# Altium schematic sheet 05_Pressure_and_LoadCell.SchDoc
size A4; DocumentNumber: 5; SheetNumber: 5; SheetTotal: 7
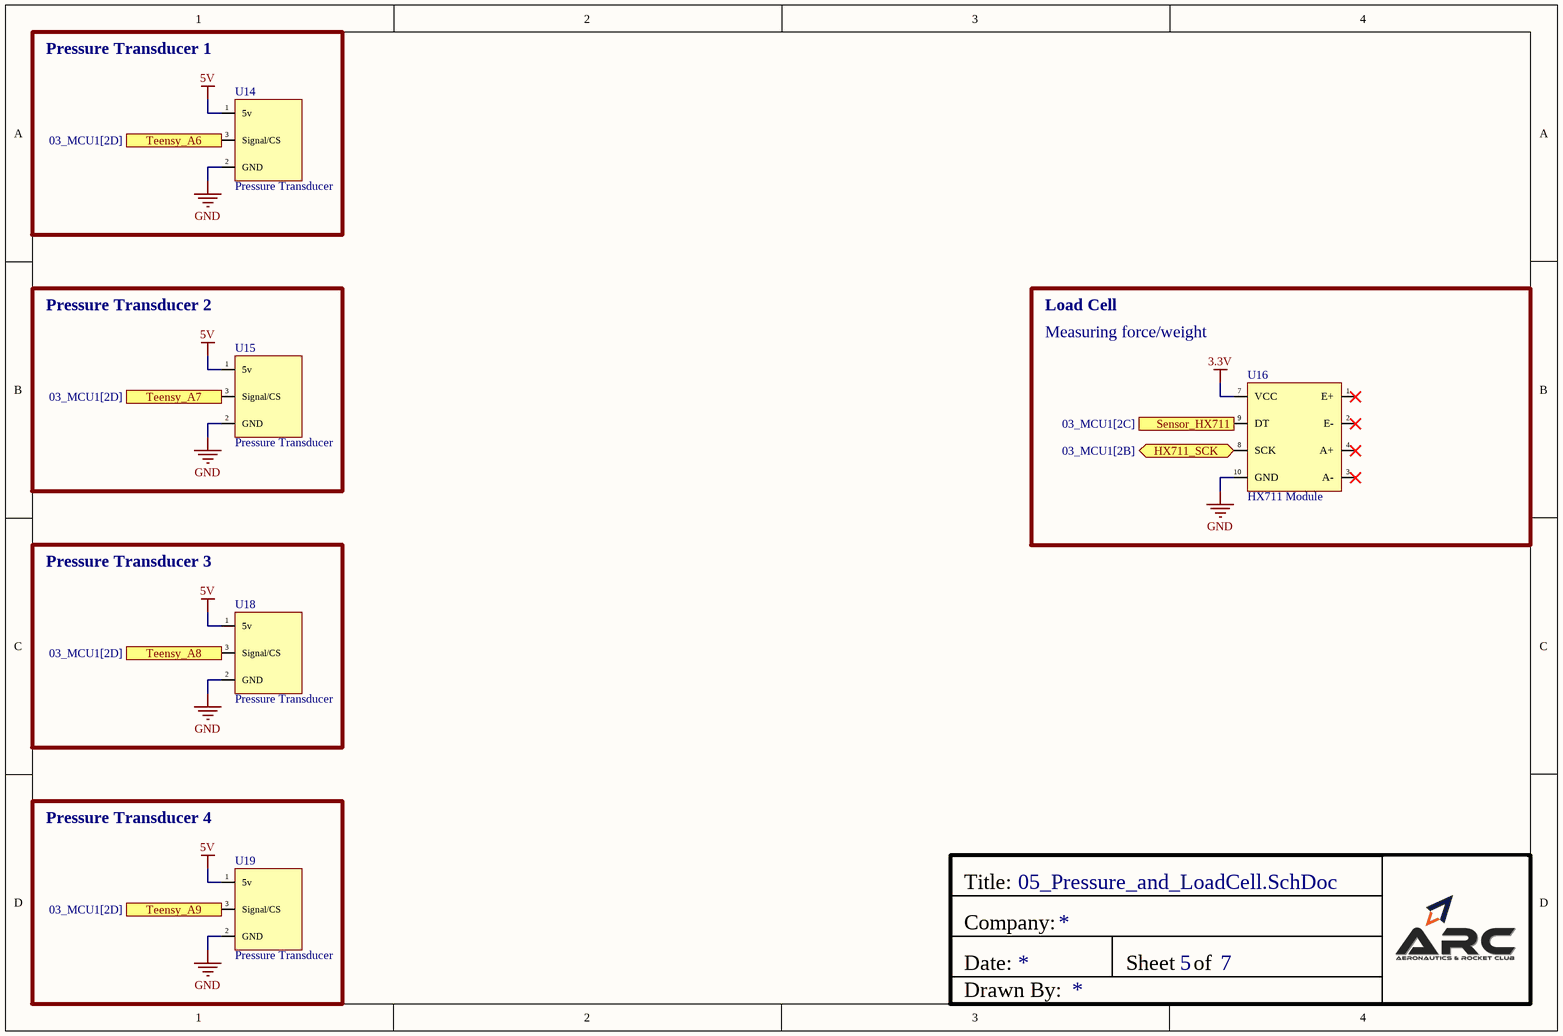
[diagram p0: 05_Pressure_and_LoadCell.SchDoc]

## Parts
U14  Pressure Transducer  [3-PIN AVIATION CONNECTOR]
U15  Pressure Transducer  [3-PIN AVIATION CONNECTOR]
U16  HX711 Module  [HX711 Module]
U18  Pressure Transducer  [3-PIN AVIATION CONNECTOR]
U19  Pressure Transducer  [3-PIN AVIATION CONNECTOR]

## Blocks framed on the sheet
Pressure Transducer 1: U14
Pressure Transducer 2: U15
Pressure Transducer 3: U18
Pressure Transducer 4: U19

## Ports
HX711_SCK (bidir, see 03_MCU1[2B]), Sensor_HX711 (in, see 03_MCU1[2C]), Teensy_A6 (in, see 03_MCU1[2D]), Teensy_A7 (in, see 03_MCU1[2D]), Teensy_A8 (in, see 03_MCU1[2D]), Teensy_A9 (in, see 03_MCU1[2D])

## Nets
3.3V: U16.7(VCC)
5V: U14.1(5v) U15.1(5v) U18.1(5v) U19.1(5v)
GND: U14.2(GND) U15.2(GND) U16.10(GND) U18.2(GND) U19.2(GND)
HX711_SCK: U16.8(SCK) ; port HX711_SCK
Sensor_HX711: U16.9(DT) ; port Sensor_HX711
Teensy_A6: U14.3(Signal/CS) ; port Teensy_A6
Teensy_A7: U15.3(Signal/CS) ; port Teensy_A7
Teensy_A8: U18.3(Signal/CS) ; port Teensy_A8
Teensy_A9: U19.3(Signal/CS) ; port Teensy_A9

Not connected (* = marked no-connect by the designer): U16 1(E+)* 2(E-)* 3(A-)* 4(A+)*

## Notes on the sheet
- Load Cell
- Measuring force/weight
- Title:
- Company:
- Date:
- Sheet
- of
- Drawn By: